# Altium project FPGA Board.PrjPcb (part 3 of 4)

## Sheet FPGA Power.SchDoc
size A2; SheetNumber: 5; SheetTotal: 5
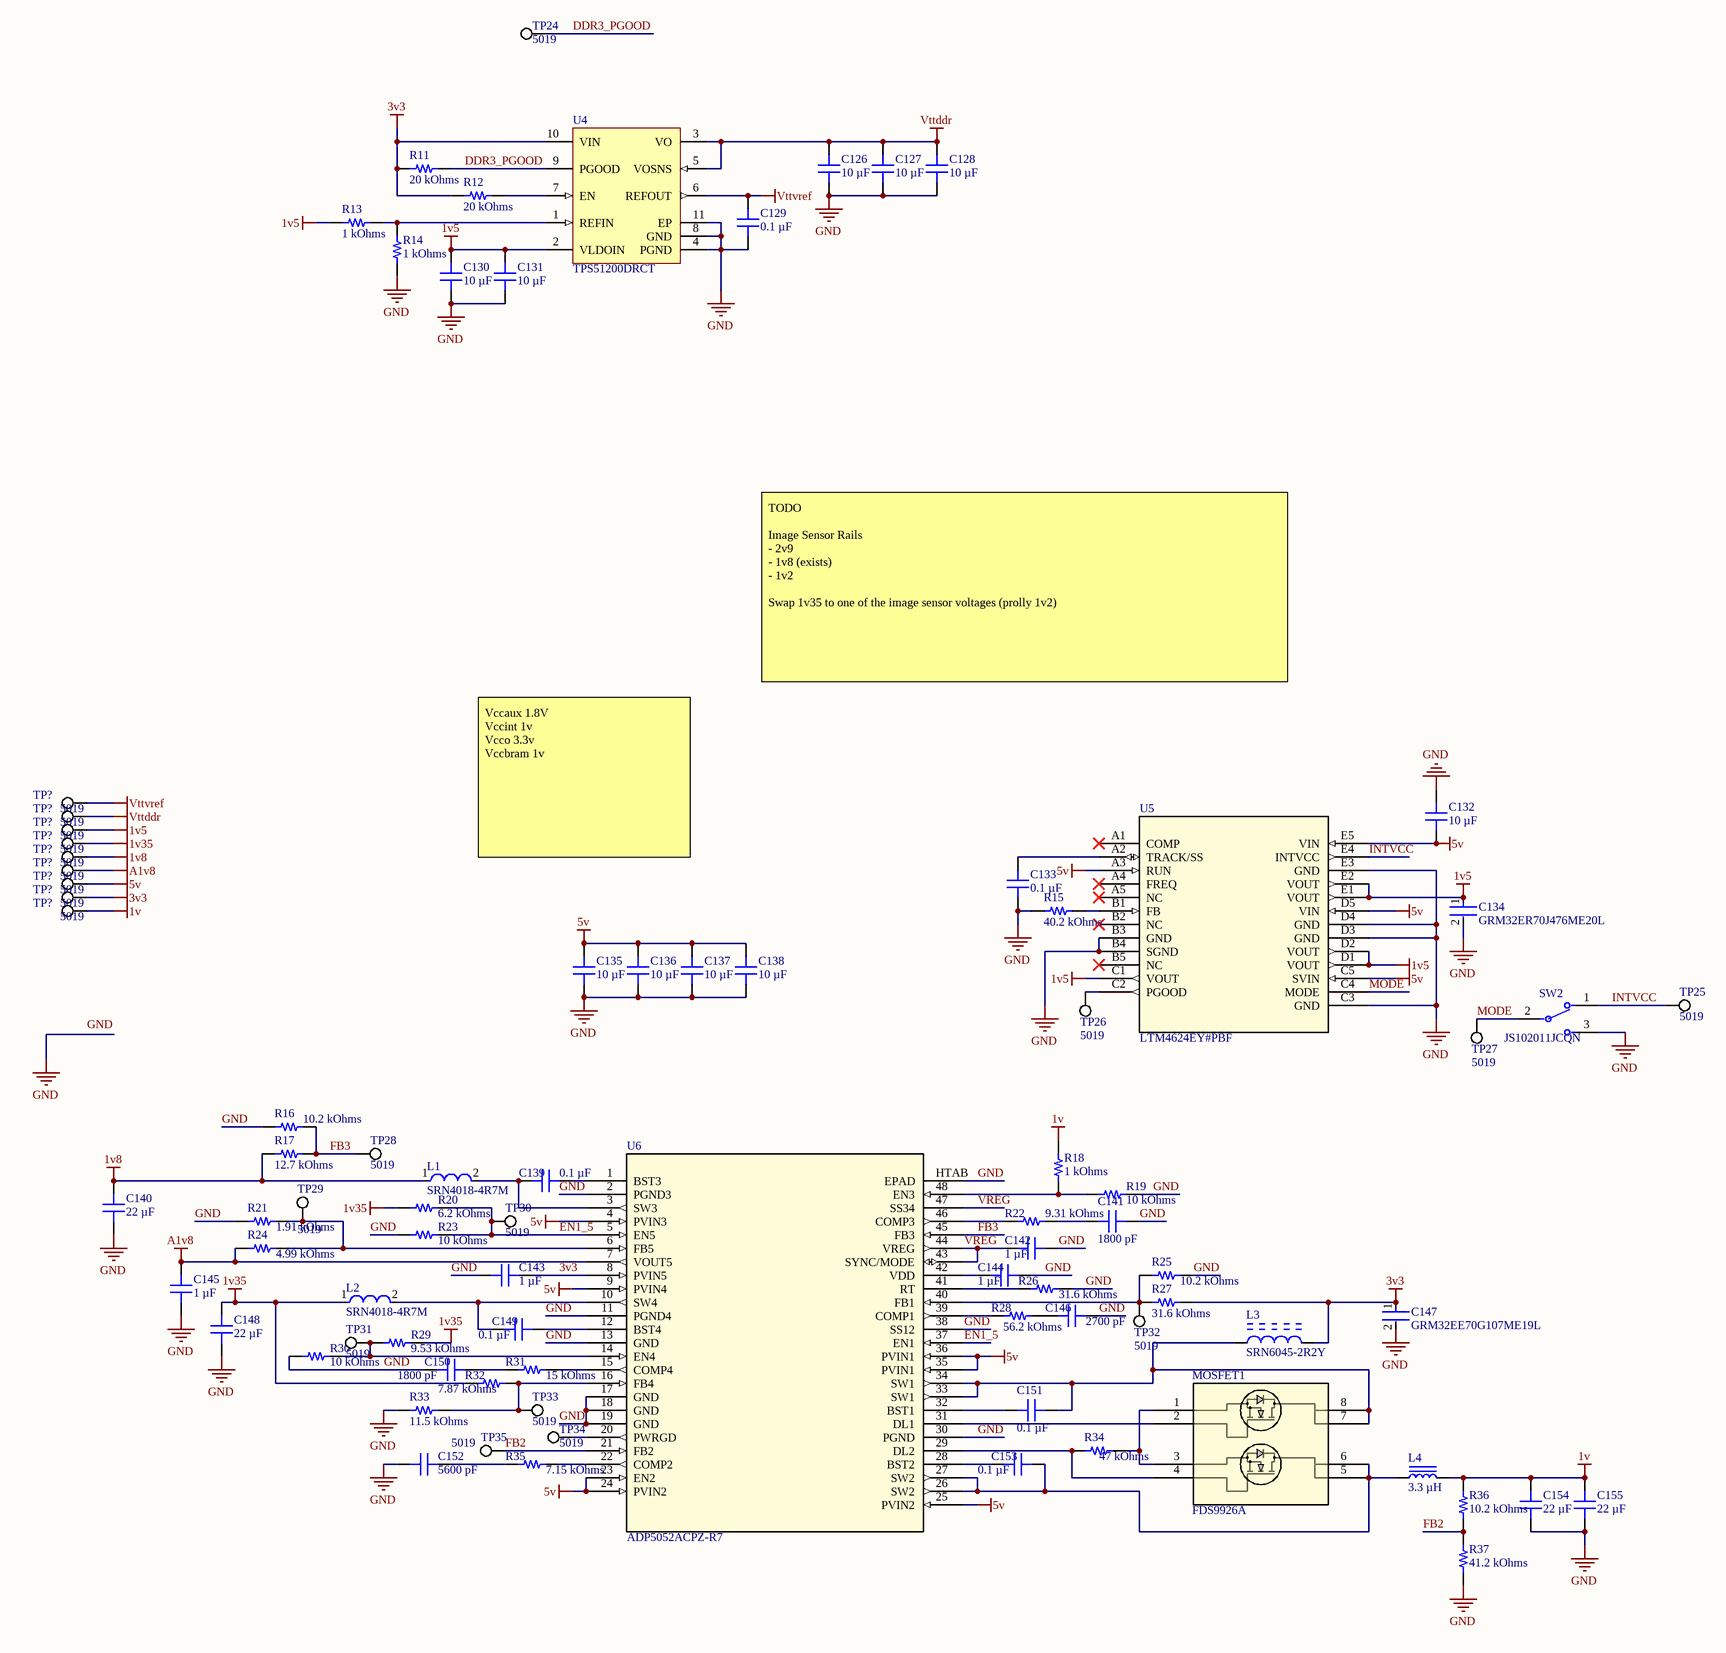
[diagram p7: FPGA Power.SchDoc]

### Parts
(Parts that share a designator on the sheet are numbered #1, #2 ... from top to bottom, then left to right.)
C126  10 µF  [CAP 0603_1608]
C127  10 µF  [CAP 0603_1608]
C128  10 µF  [CAP 0603_1608]
C129  0.1 µF  [CAP 0603_1608]
C130  10 µF  [CAP 0603_1608]
C131  10 µF  [CAP 0603_1608]
C132  10 µF  [CAP 0603_1608]
C133  0.1 µF  [CAP 0603_1608]
C134  GRM32ER70J476ME20L  [FP-GRM32E-0_3-0_2-IPC_C]
C135  10 µF  [CAP 0603_1608]
C136  10 µF  [CAP 0603_1608]
C137  10 µF  [CAP 0603_1608]
C138  10 µF  [CAP 0603_1608]
C139  0.1 µF  [CAP 0603_1608]
C140  22 µF  [CAP 0805_2012]
C141  1800 pF  [CAP 0603_1608]
C142  1 µF  [CAP 0603_1608]
C143  1 µF  [CAP 0603_1608]
C144  1 µF  [CAP 0603_1608]
C145  1 µF  [CAP 0603_1608]
C146  2700 pF  [CAP 0603_1608]
C147  GRM32EE70G107ME19L  [FP-GRM32E-0_3-0_2-MFG]
C148  22 µF  [CAP 0805_2012]
C149  0.1 µF  [CAP 0603_1608]
C150  1800 pF  [CAP 0603_1608]
C151  0.1 µF  [CAP 0603_1608]
C152  5600 pF  [CAP 0603_1608]
C153  0.1 µF  [CAP 0603_1608]
C154  22 µF  [CAP 0805_2012]
C155  22 µF  [CAP 0805_2012]
L1  SRN4018-4R7M  [FP-SRN4018-MFG]
L2  SRN4018-4R7M  [FP-SRN4018-MFG]
L3  SRN6045-2R2Y  [BOUR-SRN6045_V]
L4  3.3 µH  [BOURNS SRN4018]
MOSFET1  FDS9926A  [SOIC8_751EB_ONS]
R11  20 kOhms  [RES 0603_1608]
R12  20 kOhms  [RES 0603_1608]
R13  1 kOhms  [RES 0603_1608]
R14  1 kOhms  [RES 0603_1608]
R15  40.2 kOhms  [RES 0603_1608]
R16  10.2 kOhms  [RES 0603_1608]
R17  12.7 kOhms  [RES 0603_1608]
R18  1 kOhms  [RES 0603_1608]
R19  10 kOhms  [RES 0603_1608]
R20  6.2 kOhms  [RES 0603_1608]
R21  1.91 kOhms  [RES 0603_1608]
R22  9.31 kOhms  [RES 0603_1608]
R23  10 kOhms  [RES 0603_1608]
R24  4.99 kOhms  [RES 0603_1608]
R25  10.2 kOhms  [RES 0603_1608]
R26  31.6 kOhms  [RES 0603_1608]
R27  31.6 kOhms  [RES 0603_1608]
R28  56.2 kOhms  [RES 0603_1608]
R29  9.53 kOhms  [RES 0603_1608]
R30  10 kOhms  [RES 0603_1608]
R31  15 kOhms  [RES 0603_1608]
R32  7.87 kOhms  [RES 0603_1608]
R33  11.5 kOhms  [RES 0603_1608]
R34  47 kOhms  [RES 0603_1608]
R35  7.15 kOhms  [RES 0603_1608]
R36  10.2 kOhms  [RES 0603_1608]
R37  41.2 kOhms  [RES 0603_1608]
SW2  JS102011JCQN  [FP-JS102011JCQN-MFG]
TP24  5019  [KSTN-5019_V]
TP25  5019  [KSTN-5019_V]
TP26  5019  [KSTN-5019_V]
TP27  5019  [KSTN-5019_V]
TP28  5019  [KSTN-5019_V]
TP29  5019  [KSTN-5019_V]
TP30  5019  [KSTN-5019_V]
TP31  5019  [KSTN-5019_V]
TP32  5019  [KSTN-5019_V]
TP33  5019  [KSTN-5019_V]
TP34  5019  [KSTN-5019_V]
TP35  5019  [KSTN-5019_V]
TP?#1  5019  [KSTN-5019_V]
TP?#2  5019  [KSTN-5019_V]
TP?#3  5019  [KSTN-5019_V]
TP?#4  5019  [KSTN-5019_V]
TP?#5  5019  [KSTN-5019_V]
TP?#6  5019  [KSTN-5019_V]
TP?#7  5019  [KSTN-5019_V]
TP?#8  5019  [KSTN-5019_V]
TP?#9  5019  [KSTN-5019_V]
U4  TPS51200DRCT  [DRC0010J_V]
U5  LTM4624EY#PBF  [BGA-25_6P25X6P25_LIT]
U6  ADP5052ACPZ-R7  [CP_48_13_ADI]

### Nets
1v: C154.2 C155.2 L4.2 R18.2 R36.2 TP?#9.1  [project net Vccbram]
1v5: C130.2 C131.2 C134.1 R13.1 TP?#3.1 U4.2(VLDOIN) U5.C1(VOUT) U5.D1(VOUT) U5.D2(VOUT) U5.E1(VOUT) U5.E2(VOUT)  [project net Vdd]
1v8: C140.2 L1.1 R17.1 TP?#5.1  [project net Vccaux]
1v35: C148.2 L2.1 R20.1 R29.2 R32.1 TP?#4.1
3v3: C143.2 C147.1 L3.2 R11.2 R12.2 R27.2 TP?#8.1 U4.10(VIN) U6.8(PVIN5)
5v: C132.1 C135.2 C136.2 C137.2 C138.2 TP?#7.1 U5.A3(RUN) U5.C5(SVIN) U5.D5(VIN) U5.E5(VIN) U6.4(PVIN3) U6.9(PVIN4) U6.23(EN2) U6.24(PVIN2) U6.25(PVIN2) U6.35(PVIN1) U6.36(PVIN1)
A1v8: C145.1 R24.1 TP?#6.1 U6.7(VOUT5)
GND: C126.1 C127.1 C128.1 C129.1 C130.1 C131.1 C132.2 C133.1 C134.2 C135.1 C136.1 C137.1 C138.1 C140.1 C141.2 C142.2 C143.1 C144.2 C145.2 C146.2 C147.2 C148.1 C150.1 C152.1 C154.1 C155.1 R14.1 R15.1 R16.1 R19.2 R21.1 R23.1 R25.2 R26.2 R30.1 R33.1 R37.1 SW2.3 U4.4(PGND) U4.8(GND) U4.11(EP) U5.B3(GND) U5.B4(SGND) U5.C3(GND) U5.D3(GND) U5.D4(GND) U5.E3(GND) U6.2(PGND3) U6.11(PGND4) U6.13(GND) U6.17(GND) U6.18(GND) U6.19(GND) U6.30(PGND) U6.38(SS12) U6.HTAB(EPAD)  [project net DM0]
Vttddr: C126.2 C127.2 C128.2 TP?#2.1 U4.3(VO) U4.5(VOSNS)  [project net Vtt]
Vttvref: C129.2 TP?#1.1 U4.6(REFOUT)  [project net Vrefca]
DDR3_PGOOD: R11.1 TP24.1 U4.9(PGOOD)
EN1_5: R20.2 R23.2 TP30.1 U6.5(EN5) U6.37(EN1)
FB2: R36.1 R37.2 TP35.1 U6.21(FB2)
FB3: R16.2 R17.2 TP28.1 U6.45(FB3)
INTVCC: SW2.1 TP25.1 U5.E4(INTVCC)
MODE: SW2.2 TP27.1 U5.C4(MODE)
VREG: C142.1 U6.43(SYNC/MODE) U6.44(VREG) U6.47(SS34)
NetC133_2: C133.2 U5.A2(TRACK/SS)
NetC139_1: C139.1 L1.2 U6.3(SW3)
NetC139_2: C139.2 U6.1(BST3)
NetC141_1: C141.1 R22.2
NetC144_1: C144.1 U6.42(VDD)
NetC146_1: C146.1 R28.2
NetC149_1: C149.1 L2.2 U6.10(SW4)
NetC149_2: C149.2 U6.12(BST4)
NetC150_2: C150.2 R31.1
NetC151_1: C151.1 U6.32(BST1)
NetC151_2: C151.2 L3.1 MOSFET1.7 MOSFET1.8 U6.33(SW1) U6.34(SW1)
NetC152_2: C152.2 R35.1
NetC153_1: C153.1 U6.28(BST2)
NetC153_2: C153.2 L4.1 MOSFET1.5 MOSFET1.6 U6.26(SW2) U6.27(SW2)
NetMOSFET1_1: MOSFET1.1 MOSFET1.3 R34.2
NetMOSFET1_2: MOSFET1.2 U6.31(DL1)
NetMOSFET1_4: MOSFET1.4 R34.1 U6.29(DL2)
NetR12_1: R12.1 U4.7(EN)
NetR13_2: R13.2 R14.2 U4.1(REFIN)
NetR15_2: R15.2 U5.B1(FB)
NetR18_1: R18.1 R19.1 U6.48(EN3)
NetR21_2: R21.2 R24.2 TP29.1 U6.6(FB5)
NetR22_1: R22.1 U6.46(COMP3)
NetR25_1: R25.1 R27.1 TP32.1 U6.40(FB1)
NetR26_1: R26.1 U6.41(RT)
NetR28_1: R28.1 U6.39(COMP1)
NetR29_1: R29.1 R30.2 TP31.1 U6.14(EN4)
NetR31_2: R31.2 U6.15(COMP4)
NetR32_2: R32.2 R33.2 TP33.1 U6.16(FB4)
NetR35_2: R35.2 U6.22(COMP2)
NetTP26_1: TP26.1 U5.C2(PGOOD)
NetTP34_1: TP34.1 U6.20(PWRGD)

Not connected (* = marked no-connect by the designer): U5 A1(COMP)* A4(FREQ)* A5(NC)* B2(NC)* B5(NC)*

### Notes on the sheet
- TODO
  Image Sensor Rails
  - 2v9
  - 1v8 (exists)
  - 1v2
  Swap 1v35 to one of the image sensor voltages (prolly 1v2)
- Vccaux 1.8V
  Vccint 1v
  Vcco 3.3v
  Vccbram 1v
- Labels drawn without touching a wire or pin: GND

### Library data of the parts
C126-C128 C130-C132 C135-C138 = GRM188R61E106KA73D: CAP CER 10UF 25V X5R 0603; manufacturer: Murata Electronics; Tolerance: ±10%; Part Number: GRM188R61E106KA73D; Value: 10 µF; Applications: General Purpose; Capacitance: 10 µF; componentlink1description: Datasheet; componentlink1url: https://search.murata.co.jp/Ceramy/image/img/A01X/G101/ENG/GRM188R61E106KA73-01.pdf; componentlink2description: DigiKey Link; componentlink2url: https://www.digikey.com/en/products/detail/murata-electronics/GRM188R61E106KA73D/9867922; Device Package: 0603 (1608 Metric); lastupdated: 2023-09-26 7:09:11 PM; Lifecycle Status: Active; Minimum Order: 1; Mounting Type: Surface Mount, MLCC; Operating Temperature: -55°C ~ 85°C; Package / Case: 0603 (1608 Metric); packaging: TapeAndReel; partid: 12669; Part Status: Active; price: 0.03; series: GRM; Size / Dimension: 0.063" L x 0.031" W (1.60mm x 0.80mm); Supplier 1: DigiKey; Supplier Part Number 1: 490-18214-1-ND; Temperature Coefficient: X5R; Thickness (Max): 0.039" (1.00mm); Voltage - Rated: 25V
C129 C133 C139 C149 C151 C153 = CL10B104KB8NNNC: CAP CER 0.1UF 50V X7R 0603; manufacturer: Samsung Electro-Mechanics; Tolerance: ±10%; Part Number: CL10B104KB8NNNC; Value: 0.1 µF; Applications: General Purpose; Capacitance: 0.1 µF; componentlink1description: Datasheet; componentlink1url: http://www.samsungsem.com/kr/support/product-search/mlcc/CL10B104KB8NNNC.jsp; componentlink2description: DigiKey Link; componentlink2url: https://www.digikey.com/en/products/detail/samsung-electro-mechanics/CL10B104KB8NNNC/3886658; Device Package: 0603 (1608 Metric); lastupdated: 2023-09-26 7:09:15 PM; Lifecycle Status: Active; Minimum Order: 1; Mounting Type: Surface Mount, MLCC; Operating Temperature: -55°C ~ 125°C; Package / Case: 0603 (1608 Metric); packaging: TapeAndReel; partid: 9788; Part Status: Active; price: 0.01; series: CL; Size / Dimension: 0.063" L x 0.031" W (1.60mm x 0.80mm); Supplier 1: DigiKey; Supplier Part Number 1: 1276-1000-1-ND; Temperature Coefficient: X7R; Thickness (Max): 0.035" (0.90mm); Voltage - Rated: 50V
C134 = CMP-06035-057102-1: Chip Multilayer Ceramic Capacitors for General Purpose, 1210, 47uF, X7R, 15%, 20%, 6.3V; Capacitance: 47uF; Radiation Hardening: No; Termination: SMD/SMT; Lead Free: Lead Free; Length: 3.2mm; Depth: 2.5mm; Thickness: 0.106inch; Case Code (Metric): 3225; Width: 0.098inch; Dielectric: X7R; Case/Package: 1210; Mount: Surface Mount; Packaging: Tape and Reel; Package Quantity: 1; Height: 2.5mm; Tolerance: 20%; Max Operating Temperature: 125°C; Voltage Rating (DC): 6.3V; Case Code (Imperial): 1210; Min Operating Temperature: -55°C; Voltage Rating: 6.3V
C140 C148 C154 C155 = GRM21BR61E226ME44K: CAP CER 22UF 25V X5R 0805; manufacturer: Murata Electronics; Tolerance: ±20%; Part Number: GRM21BR61E226ME44K; Value: 22 µF; Applications: General Purpose; Capacitance: 22 µF; componentlink1description: Datasheet; componentlink1url: https://search.murata.co.jp/Ceramy/image/img/A01X/G101/ENG/GRM21BR61E226ME44-01.pdf; componentlink2description: DigiKey Link; componentlink2url: https://www.digikey.com/en/products/detail/murata-electronics/GRM21BR61E226ME44K/4905534; Device Package: 0805 (2012 Metric); lastupdated: 2023-09-26 7:13:45 PM; Lifecycle Status: Active; Minimum Order: 1; Mounting Type: Surface Mount, MLCC; Operating Temperature: -55°C ~ 85°C; Package / Case: 0805 (2012 Metric); packaging: TapeAndReel; partid: 39870; Part Status: Active; price: 0.05; series: GRM; Size / Dimension: 0.079" L x 0.049" W (2.00mm x 1.25mm); Supplier 1: DigiKey; Supplier Part Number 1: 490-14661-1-ND; Temperature Coefficient: X5R; Thickness (Max): 0.057" (1.45mm); Voltage - Rated: 25V
C141 C150 = CC0603KRX7R9BB182: CAP CER 1800PF 50V X7R 0603; manufacturer: Yageo; Tolerance: ±10%; Part Number: CC0603KRX7R9BB182; Value: 1800 pF; Applications: General Purpose; Capacitance: 1800 pF; componentlink1description: Datasheet; componentlink1url: https://www.yageo.com/upload/media/product/productsearch/datasheet/mlcc/UPY-GPHC_X7R_6.3V-to-50V_18.pdf; componentlink2description: DigiKey Link; componentlink2url: https://www.digikey.com/en/products/detail/yageo/CC0603KRX7R9BB182/5883800; Device Package: 0603 (1608 Metric); lastupdated: 2023-09-26 7:09:21 PM; Lifecycle Status: Active; Minimum Order: 1; Mounting Type: Surface Mount, MLCC; Operating Temperature: -55°C ~ 125°C; Package / Case: 0603 (1608 Metric); packaging: TapeAndReel; partid: 5183; Part Status: Active; price: 0.01; series: CC; Size / Dimension: 0.063" L x 0.031" W (1.60mm x 0.80mm); Supplier 1: DigiKey; Supplier Part Number 1: 311-3373-1-ND; Temperature Coefficient: X7R; Thickness (Max): 0.035" (0.90mm); Voltage - Rated: 50V
C142-C145 = CL10A105KA8NNNC: CAP CER 1UF 25V X5R 0603; manufacturer: Samsung Electro-Mechanics; Tolerance: ±10%; Part Number: CL10A105KA8NNNC; Value: 1 µF; Applications: General Purpose; Capacitance: 1 µF; componentlink1description: Datasheet; componentlink1url: http://www.samsungsem.com/kr/support/product-search/mlcc/CL10A105KA8NNNC.jsp; componentlink2description: DigiKey Link; componentlink2url: https://www.digikey.com/en/products/detail/samsung-electro-mechanics/CL10A105KA8NNNC/3886760; Device Package: 0603 (1608 Metric); lastupdated: 2023-09-26 7:09:21 PM; Lifecycle Status: Active; Minimum Order: 1; Mounting Type: Surface Mount, MLCC; Operating Temperature: -55°C ~ 85°C; Package / Case: 0603 (1608 Metric); packaging: TapeAndReel; partid: 5508; Part Status: Active; price: 0.01; series: CL; Size / Dimension: 0.063" L x 0.031" W (1.60mm x 0.80mm); Supplier 1: DigiKey; Supplier Part Number 1: 1276-1102-1-ND; Temperature Coefficient: X5R; Thickness (Max): 0.035" (0.90mm); Voltage - Rated: 25V
C146 = CC0603KRX7R9BB272: CAP CER 2700PF 50V X7R 0603; manufacturer: Yageo; Tolerance: ±10%; Part Number: CC0603KRX7R9BB272; Value: 2700 pF; Applications: General Purpose; Capacitance: 2700 pF; componentlink1description: Datasheet; componentlink1url: https://www.yageo.com/upload/media/product/productsearch/datasheet/mlcc/UPY-GPHC_X7R_6.3V-to-50V_18.pdf; componentlink2description: DigiKey Link; componentlink2url: https://www.digikey.com/en/products/detail/yageo/CC0603KRX7R9BB272/5195216; Device Package: 0603 (1608 Metric); lastupdated: 2023-09-26 7:09:18 PM; Lifecycle Status: Active; Minimum Order: 1; Mounting Type: Surface Mount, MLCC; Operating Temperature: -55°C ~ 125°C; Package / Case: 0603 (1608 Metric); packaging: TapeAndReel; partid: 7860; Part Status: Active; price: 0.01; series: CC; Size / Dimension: 0.063" L x 0.031" W (1.60mm x 0.80mm); Supplier 1: DigiKey; Supplier Part Number 1: 311-1809-1-ND; Temperature Coefficient: X7R; Thickness (Max): 0.035" (0.90mm); Voltage - Rated: 50V
C147 = CMP-06035-033326-1: Chip Multilayer Ceramic Capacitors for General Purpose, 1210, 100uF, X7U, +22%/-56%, 20%, 4V; Voltage Rating (DC): 4V; Height: 2.5mm; Lead Free: Lead Free; Max Operating Temperature: 125°C; Capacitance: 100uF; Case Code (Imperial): 1210; Package Quantity: 1; Length: 3.2mm; Number of Pins: 2; Radiation Hardening: No; Case/Package: 1210; Tolerance: 20%; Width: 2.5mm; Packaging: Tape and Reel; Depth: 2.5mm; Min Operating Temperature: -55°C; Dielectric: X7U; Case Code (Metric): 3225; Material: Ceramic; Lead Pitch: 1mm; Mount: Surface Mount; Voltage Rating: 4V; REACH SVHC: No SVHC; Termination: SMD/SMT; Thickness: 0.106inch
C152 = CL10B562KB8NNNC: CAP CER 5600PF 50V X7R 0603; manufacturer: Samsung Electro-Mechanics; Tolerance: ±10%; Part Number: CL10B562KB8NNNC; Value: 5600 pF; Applications: General Purpose; Capacitance: 5600 pF; componentlink1description: Datasheet; componentlink1url: http://www.samsungsem.com/kr/support/product-search/mlcc/CL10B562KB8NNNC.jsp; componentlink2description: DigiKey Link; componentlink2url: https://www.digikey.com/en/products/detail/samsung-electro-mechanics/CL10B562KB8NNNC/3887749; Device Package: 0603 (1608 Metric); lastupdated: 2023-09-26 7:09:04 PM; Lifecycle Status: Active; Minimum Order: 1; Mounting Type: Surface Mount, MLCC; Operating Temperature: -55°C ~ 125°C; Package / Case: 0603 (1608 Metric); packaging: TapeAndReel; partid: 16118; Part Status: Active; price: 0.01; series: CL; Size / Dimension: 0.063" L x 0.031" W (1.60mm x 0.80mm); Supplier 1: DigiKey; Supplier Part Number 1: 1276-2091-1-ND; Temperature Coefficient: X7R; Thickness (Max): 0.035" (0.90mm); Voltage - Rated: 50V
L1 L2 = CMP-07248-000014-1: FIXED IND 4.7UH 1.9A 84 MOHM SMD; Manufacturer: Bourns; Q Factor: 9; Series Resistance: 0.084Ω; Test Frequency: 7.96MHz; Self Resonant Frequency: 35MHz; Tolerance: 20%; Core Material: Ferrite; Shielding: true; Saturation Current: 2A; Lead Free: Yes; Rms Current: 1.9A; Temperature: -40°C to +125°C; Value: 4.7uH; Inductance: 4.7uH; Device Class L1: Passive Components; Automotive: No; Octopart: https://octopart.com/srn4018-4r7m-bourns-25452396; Mouser Description: Fixed Inductors 4.7uH 20% SMD 4018; Package: SRN4018; Height: 1.8mm; Device Class L3: Fixed Inductors; ComponentLink2Description: Datasheet; Composition: Wirewound; Category: Ind; RoHS: TRUE; Manufacturer Part Number: SRN4018-4R7M; ComponentLink2URL: https://www.bourns.com/docs/Product-Datasheets/SRN4018.pdf; Temperature Range High: +125°C; Temperature Range Low: -40°C; Digikey Description: FIXED IND 4.7UH 1.9A 84 MOHM SMD; Device Class L2: Inductors
L3 = CMP-2000-07142-1: Semi-Shielded Power Inductor, 2.2 uH, +/- 30%, 3.5 A, -40 to 125 degC, 2-Pin SMD, RoHS, Tape and Reel; Manufacturer: Bourns; Kits: SRN-LAB1-ND / -INDUCTORKIT; Other Names: SRN6045-2R2YCT; EDA / CAD Models: DownloadfromAcceleratedDesigns; Current Rating: 3.5A; 3D Model: SRN6045.stp; Q @ Freq: 15@7.96MHz; Frequency - Self Resonant: 35MHz; PCN Assembly/Origin: MagneticproductsOct/2013; Type: Wirewound; DC Resistance (DCR): 25.1mOhmMax; Product Training Modules: SRNSeries:Semi-ShieldedInductors; Frequency - Test: 100kHz; Inductance: 2.2µH; Online Catalog: SRNSeries; Material - Core: Ferrite; Current - Saturation: 6A; Size / Dimension: 0.236"Lx0.236"W(6.00mmx6.00mm); Operating Temperature: -40°C~125°C; Height - Seated (Max): 0.177"(4.50mm); Mounting Technology: SurfaceMount; Package Description: 2-Pin Surface Mounted Device, Body 6 x 6 mm; Series: SRN6045; Packaging: CutTape(CT); Mounting Type: SurfaceMount; Shielding: Shielded; Datasheet Version: 12/2014; Category: Inductors,Coils,Chokes; Datasheet URL: http://www.bourns.com/docs/Product-Datasheets/SRN6045.pdf; Standard Package: 1; Manufacturer URL: http://www.bourns.com/; Package Reference: SRN6045; RoHS Information: SRN6045SeriesMaterialDeclaration; Family: FixedInductors; Package / Case: Nonstandard; Tolerance: ±30%
L4 = SRN4018-3R3M: FIXED IND 3.3UH 2.2A 66 MOHM SMD; Manufacturer: Bourns Inc.; Current - Saturation: 2.3A; DC Resistance (DCR): 66mOhm Max; Frequency - Self Resonant: 45MHz; Inductance Frequency - Test: 100 kHz; Material - Core: Ferrite; Q @ Freq: 9 @ 7.96MHz; Shielding: Semi-Shielded; Tolerance: ±20%; Type: Drum Core, Wirewound; Part Number: SRN4018-3R3M; ComponentLink1Description: Datasheet; ComponentLink1URL: https://www.bourns.com/docs/Product-Datasheets/SRN4018.pdf; ComponentLink2Description: DigiKey Link; ComponentLink2URL: https://www.digikey.com/en/products/detail/bourns-inc/SRN4018-3R3M/3821621; Current Rating (Amps): 2.2 A; Device Package: Nonstandard; Height - Seated (Max): 0.071" (1.80mm); Inductance: 3.3 µH; LastUpdated: 2023-09-26 8:48:07 PM; Lifecycle Status: Active; Minimum Order: 1; Mounting Type: Surface Mount; Operating Temperature: -40°C ~ 125°C; Package / Case: Nonstandard; Packaging: TapeAndReel; PartId: 3648; Part Status: Active; Price: 0.17; Series: SRN4018; Size / Dimension: 0.157" L x 0.157" W (4.00mm x 4.00mm); Supplier 1: DigiKey; Supplier Part Number 1: SRN4018-3R3MCT-ND; Value: 3.3 µH
MOSFET1 = FDS9926A: No Description Available; Mfr_Name: onsemi; Copyright: Copyright (C) 2023 Ultra Librarian. All rights reserved.; Manufacturer_Part_Number: FDS9926A; Digi-Key_Part_Number_1: FDS9926ATR-ND; Digi-Key_Part_Number_2: FDS9926ACT-ND; Digi-Key_Part_Number_3: FDS9926ADKR-ND; Digi-Key_Part_Number_4: 2156-FDS9926A-ND; RefDes: RefDes; Type: DEV
R11 R12 = ERA-3AEB203V: RES SMD 20K OHM 0.1% 1/10W 0603; Manufacturer: Panasonic Electronic Components; Power (Watts): 0.1W, 1/10W; Temperature Coefficient: ±25ppm/°C; Part Number: ERA-3AEB203V; Value: 20 kOhms; ComponentLink1Description: Datasheet; ComponentLink1URL: https://industrial.panasonic.com/cdbs/www-data/pdf/RDM0000/AOA0000C307.pdf; ComponentLink2Description: DigiKey Link; ComponentLink2URL: https://www.digikey.com/en/products/detail/panasonic-electronic-components/ERA-3AEB203V/1465885; Composition: Thin Film; Device Package: 0603 (1608 Metric); Features: Automotive AEC-Q200; Height - Seated (Max): 0.022" (0.55mm); LastUpdated: 2023-09-24 7:36:11 PM; Lifecycle Status: Active; Minimum Order: 1; Number of Terminations: 2; Operating Temperature: -55°C ~ 155°C; Package / Case: 0603 (1608 Metric); Packaging: TapeAndReel; PartId: 5521; Part Status: Active; Price: 0.03; Ratings: AEC-Q200; Resistance: 20 kOhms; Series: ERA-3A; Size / Dimension: 0.063" L x 0.031" W (1.60mm x 0.80mm); Supplier 1: DigiKey; Supplier Part Number 1: P20KDBCT-ND; Supplier Device Package: 0603; Tolerance: ±0.1%
R13 R14 R18 = RC0603FR-071KL: RES 1K OHM 1% 1/10W 0603; Manufacturer: Yageo; Power (Watts): 0.1W, 1/10W; Temperature Coefficient: ±100ppm/°C; Part Number: RC0603FR-071KL; Value: 1 kOhms; ComponentLink1Description: Datasheet; ComponentLink1URL: https://www.yageo.com/upload/media/product/productsearch/datasheet/rchip/PYu-RC_Group_51_RoHS_L_10.pdf; ComponentLink2Description: DigiKey Link; ComponentLink2URL: https://www.digikey.com/en/products/detail/yageo/RC0603FR-071KL/726843; Composition: Thick Film; Device Package: 0603 (1608 Metric); Features: Moisture Resistant; Height - Seated (Max): 0.022" (0.55mm); LastUpdated: 2023-09-27 7:31:37 PM; Lifecycle Status: Active; Minimum Order: 1; Number of Terminations: 2; Operating Temperature: -55°C ~ 155°C; Package / Case: 0603 (1608 Metric); Packaging: CutTape; PartId: 22600; Part Status: Active; Price: 0.01; Resistance: 1 kOhms; Series: RC_L; Size / Dimension: 0.063" L x 0.031" W (1.60mm x 0.80mm); Supplier 1: DigiKey; Supplier Part Number 1: 311-1.00KHRCT-ND; Supplier Device Package: 0603; Tolerance: ±1%
R15 = RT0603BRD0740K2L: RES SMD 40.2KOHM 0.1% 1/10W 0603; Manufacturer: Yageo; Power (Watts): 0.1W, 1/10W; Temperature Coefficient: ±25ppm/°C; Part Number: RT0603BRD0740K2L; Value: 40.2 kOhms; ComponentLink1Description: Datasheet; ComponentLink1URL: https://www.yageo.com/upload/media/product/productsearch/datasheet/rchip/PYu-RT_1-to-0.01_RoHS_L_11.pdf; ComponentLink2Description: DigiKey Link; ComponentLink2URL: https://www.digikey.com/en/products/detail/yageo/RT0603BRD0740K2L/1072517; Composition: Thin Film; Device Package: 0603 (1608 Metric); Height - Seated (Max): 0.022" (0.55mm); LastUpdated: 2023-09-27 7:32:23 PM; Lifecycle Status: Active; Minimum Order: 1; Number of Terminations: 2; Operating Temperature: -55°C ~ 155°C; Package / Case: 0603 (1608 Metric); Packaging: TapeAndReel; PartId: 10408; Part Status: Active; Price: 0.03; Resistance: 40.2 kOhms; Series: RT; Size / Dimension: 0.063" L x 0.031" W (1.60mm x 0.80mm); Supplier 1: DigiKey; Supplier Part Number 1: YAG1658CT-ND; Supplier Device Package: 0603; Tolerance: ±0.1%
R16 R25 R36 = CR0603-FX-1022ELF: RES SMD 10.2K OHM 1% 1/10W 0603; Manufacturer: Bourns Inc.; Power (Watts): 0.1W, 1/10W; Temperature Coefficient: ±100ppm/°C; Part Number: CR0603-FX-1022ELF; Value: 10.2 kOhms; ComponentLink1Description: Datasheet; ComponentLink1URL: https://www.bourns.com/docs/Product-Datasheets/CHPREZTR.pdf; ComponentLink2Description: DigiKey Link; ComponentLink2URL: https://www.digikey.com/en/products/detail/bourns-inc/CR0603-FX-1022ELF/3783667; Composition: Thick Film; Device Package: 0603 (1608 Metric); Features: Moisture Resistant; Height - Seated (Max): 0.022" (0.55mm); LastUpdated: 2023-09-26 7:36:17 PM; Lifecycle Status: Active; Minimum Order: 1; Number of Terminations: 2; Operating Temperature: -55°C ~ 155°C; Package / Case: 0603 (1608 Metric); Packaging: CutTape; PartId: 17340; Part Status: Active; Price: 0.01; Resistance: 10.2 kOhms; Series: CR0603; Size / Dimension: 0.063" L x 0.031" W (1.60mm x 0.80mm); Supplier 1: DigiKey; Supplier Part Number 1: CR0603-FX-1022ELFCT-ND; Supplier Device Package: 0603; Tolerance: ±1%
R17 = RC0603FR-0712K7L: RES 12.7K OHM 1% 1/10W 0603; Manufacturer: Yageo; Power (Watts): 0.1W, 1/10W; Temperature Coefficient: ±100ppm/°C; Part Number: RC0603FR-0712K7L; Value: 12.7 kOhms; ComponentLink1Description: Datasheet; ComponentLink1URL: https://www.yageo.com/upload/media/product/productsearch/datasheet/rchip/PYu-RC_Group_51_RoHS_L_10.pdf; ComponentLink2Description: DigiKey Link; ComponentLink2URL: https://www.digikey.com/en/products/detail/yageo/RC0603FR-0712K7L/726919; Composition: Thick Film; Device Package: 0603 (1608 Metric); Features: Moisture Resistant; Height - Seated (Max): 0.022" (0.55mm); LastUpdated: 2023-09-26 7:36:35 PM; Lifecycle Status: Active; Minimum Order: 1; Number of Terminations: 2; Operating Temperature: -55°C ~ 155°C; Package / Case: 0603 (1608 Metric); Packaging: CutTape; PartId: 12243; Part Status: Active; Price: 0.01; Resistance: 12.7 kOhms; Series: RC_L; Size / Dimension: 0.063" L x 0.031" W (1.60mm x 0.80mm); Supplier 1: DigiKey; Supplier Part Number 1: 311-12.7KHRCT-ND; Supplier Device Package: 0603; Tolerance: ±1%
R19 R23 R30 = RC0603FR-0710KL: RES 10K OHM 1% 1/10W 0603; Manufacturer: Yageo; Power (Watts): 0.1W, 1/10W; Temperature Coefficient: ±100ppm/°C; Part Number: RC0603FR-0710KL; Value: 10 kOhms; ComponentLink1Description: Datasheet; ComponentLink1URL: https://www.yageo.com/upload/media/product/productsearch/datasheet/rchip/PYu-RC_Group_51_RoHS_L_10.pdf; ComponentLink2Description: DigiKey Link; ComponentLink2URL: https://www.digikey.com/en/products/detail/yageo/RC0603FR-0710KL/726880; Composition: Thick Film; Device Package: 0603 (1608 Metric); Features: Moisture Resistant; Height - Seated (Max): 0.022" (0.55mm); LastUpdated: 2023-09-26 7:35:55 PM; Lifecycle Status: Active; Minimum Order: 1; Number of Terminations: 2; Operating Temperature: -55°C ~ 155°C; Package / Case: 0603 (1608 Metric); Packaging: CutTape; PartId: 22599; Part Status: Active; Price: 0.01; Resistance: 10 kOhms; Series: RC_L; Size / Dimension: 0.063" L x 0.031" W (1.60mm x 0.80mm); Supplier 1: DigiKey; Supplier Part Number 1: 311-10.0KHRCT-ND; Supplier Device Package: 0603; Tolerance: ±1%
R20 = RC0603FR-076K2L: RES 6.2K OHM 1% 1/10W 0603; Manufacturer: Yageo; Power (Watts): 0.1W, 1/10W; Temperature Coefficient: ±100ppm/°C; Part Number: RC0603FR-076K2L; Value: 6.2 kOhms; ComponentLink1Description: Datasheet; ComponentLink1URL: https://www.yageo.com/upload/media/product/productsearch/datasheet/rchip/PYu-RC_Group_51_RoHS_L_10.pdf; ComponentLink2Description: DigiKey Link; ComponentLink2URL: https://www.digikey.com/en/products/detail/yageo/RC0603FR-076K2L/727319; Composition: Thick Film; Device Package: 0603 (1608 Metric); Features: Moisture Resistant; Height - Seated (Max): 0.022" (0.55mm); LastUpdated: 2023-09-26 7:36:35 PM; Lifecycle Status: Active; Minimum Order: 1; Number of Terminations: 2; Operating Temperature: -55°C ~ 155°C; Package / Case: 0603 (1608 Metric); Packaging: CutTape; PartId: 12222; Part Status: Active; Price: 0.01; Resistance: 6.2 kOhms; Series: RC_L; Size / Dimension: 0.063" L x 0.031" W (1.60mm x 0.80mm); Supplier 1: DigiKey; Supplier Part Number 1: 311-6.20KHRCT-ND; Supplier Device Package: 0603; Tolerance: ±1%
R21 = RC0603FR-071K91L: RES 1.91K OHM 1% 1/10W 0603; Manufacturer: Yageo; Power (Watts): 0.1W, 1/10W; Temperature Coefficient: ±100ppm/°C; Part Number: RC0603FR-071K91L; Value: 1.91 kOhms; ComponentLink1Description: Datasheet; ComponentLink1URL: https://www.yageo.com/upload/media/product/productsearch/datasheet/rchip/PYu-RC_Group_51_RoHS_L_10.pdf; ComponentLink2Description: DigiKey Link; ComponentLink2URL: https://www.digikey.com/en/products/detail/yageo/RC0603FR-071K91L/726877; Composition: Thick Film; Device Package: 0603 (1608 Metric); Features: Moisture Resistant; Height - Seated (Max): 0.022" (0.55mm); LastUpdated: 2023-09-26 7:36:53 PM; Lifecycle Status: Active; Minimum Order: 1; Number of Terminations: 2; Operating Temperature: -55°C ~ 155°C; Package / Case: 0603 (1608 Metric); Packaging: CutTape; PartId: 7562; Part Status: Active; Price: 0.01; Resistance: 1.91 kOhms; Series: RC_L; Size / Dimension: 0.063" L x 0.031" W (1.60mm x 0.80mm); Supplier 1: DigiKey; Supplier Part Number 1: 311-1.91KHRCT-ND; Supplier Device Package: 0603; Tolerance: ±1%
R22 = RC0603FR-079K31L: RES 9.31K OHM 1% 1/10W 0603; Manufacturer: Yageo; Power (Watts): 0.1W, 1/10W; Temperature Coefficient: ±100ppm/°C; Part Number: RC0603FR-079K31L; Value: 9.31 kOhms; ComponentLink1Description: Datasheet; ComponentLink1URL: https://www.yageo.com/upload/media/product/productsearch/datasheet/rchip/PYu-RC_Group_51_RoHS_L_10.pdf; ComponentLink2Description: DigiKey Link; ComponentLink2URL: https://www.digikey.com/en/products/detail/yageo/RC0603FR-079K31L/727420; Composition: Thick Film; Device Package: 0603 (1608 Metric); Features: Moisture Resistant; Height - Seated (Max): 0.022" (0.55mm); LastUpdated: 2023-09-26 7:36:53 PM; Lifecycle Status: Active; Minimum Order: 1; Number of Terminations: 2; Operating Temperature: -55°C ~ 155°C; Package / Case: 0603 (1608 Metric); Packaging: CutTape; PartId: 7607; Part Status: Active; Price: 0.01; Resistance: 9.31 kOhms; Series: RC_L; Size / Dimension: 0.063" L x 0.031" W (1.60mm x 0.80mm); Supplier 1: DigiKey; Supplier Part Number 1: 311-9.31KHRCT-ND; Supplier Device Package: 0603; Tolerance: ±1%
R24 = RT0603BRD074K99L: RES SMD 4.99KOHM 0.1% 1/10W 0603; Manufacturer: Yageo; Power (Watts): 0.1W, 1/10W; Temperature Coefficient: ±25ppm/°C; Part Number: RT0603BRD074K99L; Value: 4.99 kOhms; ComponentLink1Description: Datasheet; ComponentLink1URL: https://www.yageo.com/upload/media/product/productsearch/datasheet/rchip/PYu-RT_1-to-0.01_RoHS_L_11.pdf; ComponentLink2Description: DigiKey Link; ComponentLink2URL: https://www.digikey.com/en/products/detail/yageo/RT0603BRD074K99L/1072563; Composition: Thin Film; Device Package: 0603 (1608 Metric); Height - Seated (Max): 0.022" (0.55mm); LastUpdated: 2023-09-26 7:37:01 PM; Lifecycle Status: Active; Minimum Order: 1; Number of Terminations: 2; Operating Temperature: -55°C ~ 155°C; Package / Case: 0603 (1608 Metric); Packaging: TapeAndReel; PartId: 5633; Part Status: Active; Price: 0.03; Resistance: 4.99 kOhms; Series: RT; Size / Dimension: 0.063" L x 0.031" W (1.60mm x 0.80mm); Supplier 1: DigiKey; Supplier Part Number 1: YAG1678CT-ND; Supplier Device Package: 0603; Tolerance: ±0.1%
R26 R27 = RK73H1JTTD3162F: RES 31.6K OHM 1% 1/10W 0603; Manufacturer: KOA Speer Electronics, Inc.; Power (Watts): 0.1W, 1/10W; Temperature Coefficient: ±100ppm/°C; Part Number: RK73H1JTTD3162F; Value: 31.6 kOhms; ComponentLink1Description: Datasheet; ComponentLink1URL: http://www.koaspeer.com/catimages/Products/RK73H/RK73H.pdf; ComponentLink2Description: DigiKey Link; ComponentLink2URL: https://www.digikey.com/en/products/detail/koa-speer-electronics-inc/RK73H1JTTD3162F/9844959; Composition: Thick Film; Device Package: 0603 (1608 Metric); Features: Automotive AEC-Q200, Moisture Resistant; Height - Seated (Max): 0.022" (0.55mm); LastUpdated: 2023-09-26 7:36:59 PM; Lifecycle Status: Active; Minimum Order: 1; Number of Terminations: 2; Operating Temperature: -55°C ~ 155°C; Package / Case: 0603 (1608 Metric); Packaging: CutTape; PartId: 6124; Part Status: Active; Price: 0.01; Ratings: AEC-Q200; Resistance: 31.6 kOhms; Series: RK73H; Size / Dimension: 0.063" L x 0.031" W (1.60mm x 0.80mm); Supplier 1: DigiKey; Supplier Part Number 1: 2019-RK73H1JTTD3162FCT-ND; Supplier Device Package: 0603; Tolerance: ±1%
R28 = RK73H1JTTD5622F: RES 56.2K OHM 1% 1/10W 0603; Manufacturer: KOA Speer Electronics, Inc.; Power (Watts): 0.1W, 1/10W; Temperature Coefficient: ±100ppm/°C; Part Number: RK73H1JTTD5622F; Value: 56.2 kOhms; ComponentLink1Description: Datasheet; ComponentLink1URL: http://www.koaspeer.com/catimages/Products/RK73H/RK73H.pdf; ComponentLink2Description: DigiKey Link; ComponentLink2URL: https://www.digikey.com/en/products/detail/koa-speer-electronics-inc/RK73H1JTTD5622F/9844991; Composition: Thick Film; Device Package: 0603 (1608 Metric); Features: Automotive AEC-Q200, Moisture Resistant; Height - Seated (Max): 0.022" (0.55mm); LastUpdated: 2023-09-26 7:35:31 PM; Lifecycle Status: Active; Minimum Order: 1; Number of Terminations: 2; Operating Temperature: -55°C ~ 155°C; Package / Case: 0603 (1608 Metric); Packaging: CutTape; PartId: 25897; Part Status: Active; Price: 0.01; Ratings: AEC-Q200; Resistance: 56.2 kOhms; Series: RK73H; Size / Dimension: 0.063" L x 0.031" W (1.60mm x 0.80mm); Supplier 1: DigiKey; Supplier Part Number 1: 2019-RK73H1JTTD5622FCT-ND; Supplier Device Package: 0603; Tolerance: ±1%
R29 = RC0603FR-079K53L: RES 9.53K OHM 1% 1/10W 0603; Manufacturer: Yageo; Power (Watts): 0.1W, 1/10W; Temperature Coefficient: ±100ppm/°C; Part Number: RC0603FR-079K53L; Value: 9.53 kOhms; ComponentLink1Description: Datasheet; ComponentLink1URL: https://www.yageo.com/upload/media/product/productsearch/datasheet/rchip/PYu-RC_Group_51_RoHS_L_10.pdf; ComponentLink2Description: DigiKey Link; ComponentLink2URL: https://www.digikey.com/en/products/detail/yageo/RC0603FR-079K53L/727421; Composition: Thick Film; Device Package: 0603 (1608 Metric); Features: Moisture Resistant; Height - Seated (Max): 0.022" (0.55mm); LastUpdated: 2023-09-26 7:36:54 PM; Lifecycle Status: Active; Minimum Order: 1; Number of Terminations: 2; Operating Temperature: -55°C ~ 155°C; Package / Case: 0603 (1608 Metric); Packaging: CutTape; PartId: 7504; Part Status: Active; Price: 0.01; Resistance: 9.53 kOhms; Series: RC_L; Size / Dimension: 0.063" L x 0.031" W (1.60mm x 0.80mm); Supplier 1: DigiKey; Supplier Part Number 1: 311-9.53KHRCT-ND; Supplier Device Package: 0603; Tolerance: ±1%
R31 = WR06X153 JTL: RES 15K OHM 5% 1/10W 0603; Manufacturer: Walsin Technology Corporation; Power (Watts): 0.1W, 1/10W; Temperature Coefficient: ±100ppm/°C; Part Number: WR06X153 JTL; Value: 15 kOhms; ComponentLink1Description: Datasheet; ComponentLink1URL: https://www.passivecomponent.com/wp-content/uploads/chipR/ASC_WR.pdf; ComponentLink2Description: DigiKey Link; ComponentLink2URL: https://www.digikey.com/en/products/detail/walsin-technology-corporation/WR06X153-JTL/13238736; Composition: Thick Film; Device Package: 0603 (1608 Metric); Height - Seated (Max): 0.024" (0.60mm); LastUpdated: 2023-09-26 7:34:57 PM; Lifecycle Status: Active; Minimum Order: 1; Number of Terminations: 2; Operating Temperature: -55°C ~ 155°C; Package / Case: 0603 (1608 Metric); Packaging: CutTape; PartId: 65342; Part Status: Active; Price: 0.01; Resistance: 15 kOhms; Series: WR; Size / Dimension: 0.063" L x 0.031" W (1.60mm x 0.80mm); Supplier 1: DigiKey; Supplier Part Number 1: 1292-WR06X153JTLCT-ND; Supplier Device Package: 0603; Tolerance: ±5%
R32 = RC0603FR-077K87L: RES 7.87K OHM 1% 1/10W 0603; Manufacturer: Yageo; Power (Watts): 0.1W, 1/10W; Temperature Coefficient: ±100ppm/°C; Part Number: RC0603FR-077K87L; Value: 7.87 kOhms; ComponentLink1Description: Datasheet; ComponentLink1URL: https://www.yageo.com/upload/media/product/productsearch/datasheet/rchip/PYu-RC_Group_51_RoHS_L_10.pdf; ComponentLink2Description: DigiKey Link; ComponentLink2URL: https://www.digikey.com/en/products/detail/yageo/RC0603FR-077K87L/727368; Composition: Thick Film; Device Package: 0603 (1608 Metric); Features: Moisture Resistant; Height - Seated (Max): 0.022" (0.55mm); LastUpdated: 2023-09-26 7:35:54 PM; Lifecycle Status: Active; Minimum Order: 1; Number of Terminations: 2; Operating Temperature: -55°C ~ 155°C; Package / Case: 0603 (1608 Metric); Packaging: CutTape; PartId: 22832; Part Status: Active; Price: 0.01; Resistance: 7.87 kOhms; Series: RC_L; Size / Dimension: 0.063" L x 0.031" W (1.60mm x 0.80mm); Supplier 1: DigiKey; Supplier Part Number 1: 311-7.87KHRCT-ND; Supplier Device Package: 0603; Tolerance: ±1%
R33 = RC0603FR-0711K5L: RES 11.5K OHM 1% 1/10W 0603; Manufacturer: Yageo; Power (Watts): 0.1W, 1/10W; Temperature Coefficient: ±100ppm/°C; Part Number: RC0603FR-0711K5L; Value: 11.5 kOhms; ComponentLink1Description: Datasheet; ComponentLink1URL: https://www.yageo.com/upload/media/product/productsearch/datasheet/rchip/PYu-RC_Group_51_RoHS_L_10.pdf; ComponentLink2Description: DigiKey Link; ComponentLink2URL: https://www.digikey.com/en/products/detail/yageo/RC0603FR-0711K5L/726901; Composition: Thick Film; Device Package: 0603 (1608 Metric); Features: Moisture Resistant; Height - Seated (Max): 0.022" (0.55mm); LastUpdated: 2023-09-26 7:36:11 PM; Lifecycle Status: Active; Minimum Order: 1; Number of Terminations: 2; Operating Temperature: -55°C ~ 155°C; Package / Case: 0603 (1608 Metric); Packaging: CutTape; PartId: 19023; Part Status: Active; Price: 0.01; Resistance: 11.5 kOhms; Series: RC_L; Size / Dimension: 0.063" L x 0.031" W (1.60mm x 0.80mm); Supplier 1: DigiKey; Supplier Part Number 1: 311-11.5KHRCT-ND; Supplier Device Package: 0603; Tolerance: ±1%
R34 = RC0603FR-0747KL: RES 47K OHM 1% 1/10W 0603; Manufacturer: Yageo; Power (Watts): 0.1W, 1/10W; Temperature Coefficient: ±100ppm/°C; Part Number: RC0603FR-0747KL; Value: 47 kOhms; ComponentLink1Description: Datasheet; ComponentLink1URL: https://www.yageo.com/upload/media/product/productsearch/datasheet/rchip/PYu-RC_Group_51_RoHS_L_10.pdf; ComponentLink2Description: DigiKey Link; ComponentLink2URL: https://www.digikey.com/en/products/detail/yageo/RC0603FR-0747KL/727253; Composition: Thick Film; Device Package: 0603 (1608 Metric); Features: Moisture Resistant; Height - Seated (Max): 0.022" (0.55mm); LastUpdated: 2023-09-26 7:35:55 PM; Lifecycle Status: Active; Minimum Order: 1; Number of Terminations: 2; Operating Temperature: -55°C ~ 155°C; Package / Case: 0603 (1608 Metric); Packaging: CutTape; PartId: 22601; Part Status: Active; Price: 0.01; Resistance: 47 kOhms; Series: RC_L; Size / Dimension: 0.063" L x 0.031" W (1.60mm x 0.80mm); Supplier 1: DigiKey; Supplier Part Number 1: 311-47.0KHRCT-ND; Supplier Device Package: 0603; Tolerance: ±1%
R35 = RK73H1JTTD7151F: RES 7.15K OHM 1% 1/10W 0603; Manufacturer: KOA Speer Electronics, Inc.; Power (Watts): 0.1W, 1/10W; Temperature Coefficient: ±100ppm/°C; Part Number: RK73H1JTTD7151F; Value: 7.15 kOhms; ComponentLink1Description: Datasheet; ComponentLink1URL: http://www.koaspeer.com/catimages/Products/RK73H/RK73H.pdf; ComponentLink2Description: DigiKey Link; ComponentLink2URL: https://www.digikey.com/en/products/detail/koa-speer-electronics-inc/RK73H1JTTD7151F/9845079; Composition: Thick Film; Device Package: 0603 (1608 Metric); Features: Automotive AEC-Q200, Moisture Resistant; Height - Seated (Max): 0.022" (0.55mm); LastUpdated: 2023-09-26 7:35:34 PM; Lifecycle Status: Active; Minimum Order: 1; Number of Terminations: 2; Operating Temperature: -55°C ~ 155°C; Package / Case: 0603 (1608 Metric); Packaging: CutTape; PartId: 25451; Part Status: Active; Price: 0.01; Ratings: AEC-Q200; Resistance: 7.15 kOhms; Series: RK73H; Size / Dimension: 0.063" L x 0.031" W (1.60mm x 0.80mm); Supplier 1: DigiKey; Supplier Part Number 1: 2019-RK73H1JTTD7151FCT-ND; Supplier Device Package: 0603; Tolerance: ±1%
R37 = RC0603FR-0741K2L: RES 41.2K OHM 1% 1/10W 0603; Manufacturer: Yageo; Power (Watts): 0.1W, 1/10W; Temperature Coefficient: ±100ppm/°C; Part Number: RC0603FR-0741K2L; Value: 41.2 kOhms; ComponentLink1Description: Datasheet; ComponentLink1URL: https://www.yageo.com/upload/media/product/productsearch/datasheet/rchip/PYu-RC_Group_51_RoHS_L_10.pdf; ComponentLink2Description: DigiKey Link; ComponentLink2URL: https://www.digikey.com/en/products/detail/yageo/RC0603FR-0741K2L/727225; Composition: Thick Film; Device Package: 0603 (1608 Metric); Features: Moisture Resistant; Height - Seated (Max): 0.022" (0.55mm); LastUpdated: 2023-09-26 7:36:34 PM; Lifecycle Status: Active; Minimum Order: 1; Number of Terminations: 2; Operating Temperature: -55°C ~ 155°C; Package / Case: 0603 (1608 Metric); Packaging: CutTape; PartId: 12414; Part Status: Active; Price: 0.01; Resistance: 41.2 kOhms; Series: RC_L; Size / Dimension: 0.063" L x 0.031" W (1.60mm x 0.80mm); Supplier 1: DigiKey; Supplier Part Number 1: 311-41.2KHRCT-ND; Supplier Device Package: 0603; Tolerance: ±1%
SW2 = CMP-10038-000010-1: SWITCH SLIDE SPDT 300MA 6V; Electrical Life: 5000Cycles; Switch Function: On-On; Actuator Material: Nylon; Actuator Length: 2mm; Actuator Type: Standard; Current Rating: 300mA; Voltage Rating (DC): 6V; Min Operating Temperature: -40°C; Throw Configuration: SPDT; Mount: Surface Mount; Switch Travel: 2mm; Max Operating Temperature: 85°C; Packaging: Cut Tape; Contact Plating: Silver; Contact Material: Copper Alloy
TP24-TP35 TP?#1-TP?#9 = CMP-1672-00008-1: Test Point, 1 Position SMD, RoHS, Tape and Reel; ComponentLink1Description: Manufacturer URL; Package Quantity: 1000; DatasheetVersion: 03/2014; Packaging: Tape and Reel; ComponentLink2URL: http://www.keyelco.com/product-pdf.cfm?p=1357; ComponentLink1URL: http://www.keyelco.com/; Mount: Surface Mount; Contact Plating: Silver; PackageDescription: 1-Pin Surface Mount Device, Body 3.81 x 2.03 mm; Pins: 1; RoHSCompliant: True; Mounting Technology: Surface Mount; ComponentLink2Description: Datasheet; PackageReference: 5019
U4 = CMP-0395-00656-2: Single Output LDO, 3 A, 2.375 to 3.5 V Input, with DDR Termination, 10-pin SON (DRC), -40 to 85 degC, Green (RoHS & no Sb/Br); Manufacturer: Texas Instruments; SubFamily: Single Channel LDO; Iq(Typ)(mA): 0.5; Vin(Max)(V): 3.5; Power Good: TRUE; Vin(Min)(V): 2.3; Iout(Max)(A): 3; Rating: Catalog; Mounting Technology: Surface Mount; DatasheetVersion: SLUS812; Eco-Plan: Green (RoHS & no Sb/Br); ComponentLink1Description: Manufacturer URL; PackageVersion: 4204102-3/L; PackageDescription: 10-Pin Plastic Small Outline, Body 3 x 3 mm, Pitch 0.5 mm; ComponentLink2Description: Datasheet; ComponentLink1URL: http://www.ti.com/; ComponentLink3Description: Package Specification; ComponentLink4Description: URL Link1; ComponentLink4URL: Samples URL:http://www.ti.com/product/tps51200#samples; ComponentLink3URL: http://www.ti.com/litv/pdf/mpds117k; PackageReference: DRC0010J; ComponentLink2URL: http://www.ti.com/general/docs/lit/getliterature.tsp?genericPartNumber=TPS51200&fileType=pdf; PartNumber: TPS51200DRCT
U5 = LTM4624EYPBF: No Description Available; Mfr_Name: Analog Devices Inc; Copyright: Copyright (C) 2023 Ultra Librarian. All rights reserved.; Manufacturer_Part_Number: LTM4624EY#PBF; RefDes: RefDes; Type: DEV
U6 = ADP5052ACPZ-R7: No Description Available; Mfr_Name: Analog Devices Inc; Copyright: Copyright (C) 2023 Ultra Librarian. All rights reserved.; Manufacturer_Part_Number: ADP5052ACPZ-R7; Digi-Key_Part_Number_1: ADP5052ACPZ-R7CT-ND; Digi-Key_Part_Number_2: ADP5052ACPZ-R7DKR-ND; Digi-Key_Part_Number_3: ADP5052ACPZ-R7TR-ND; RefDes: RefDes; Type: DEV